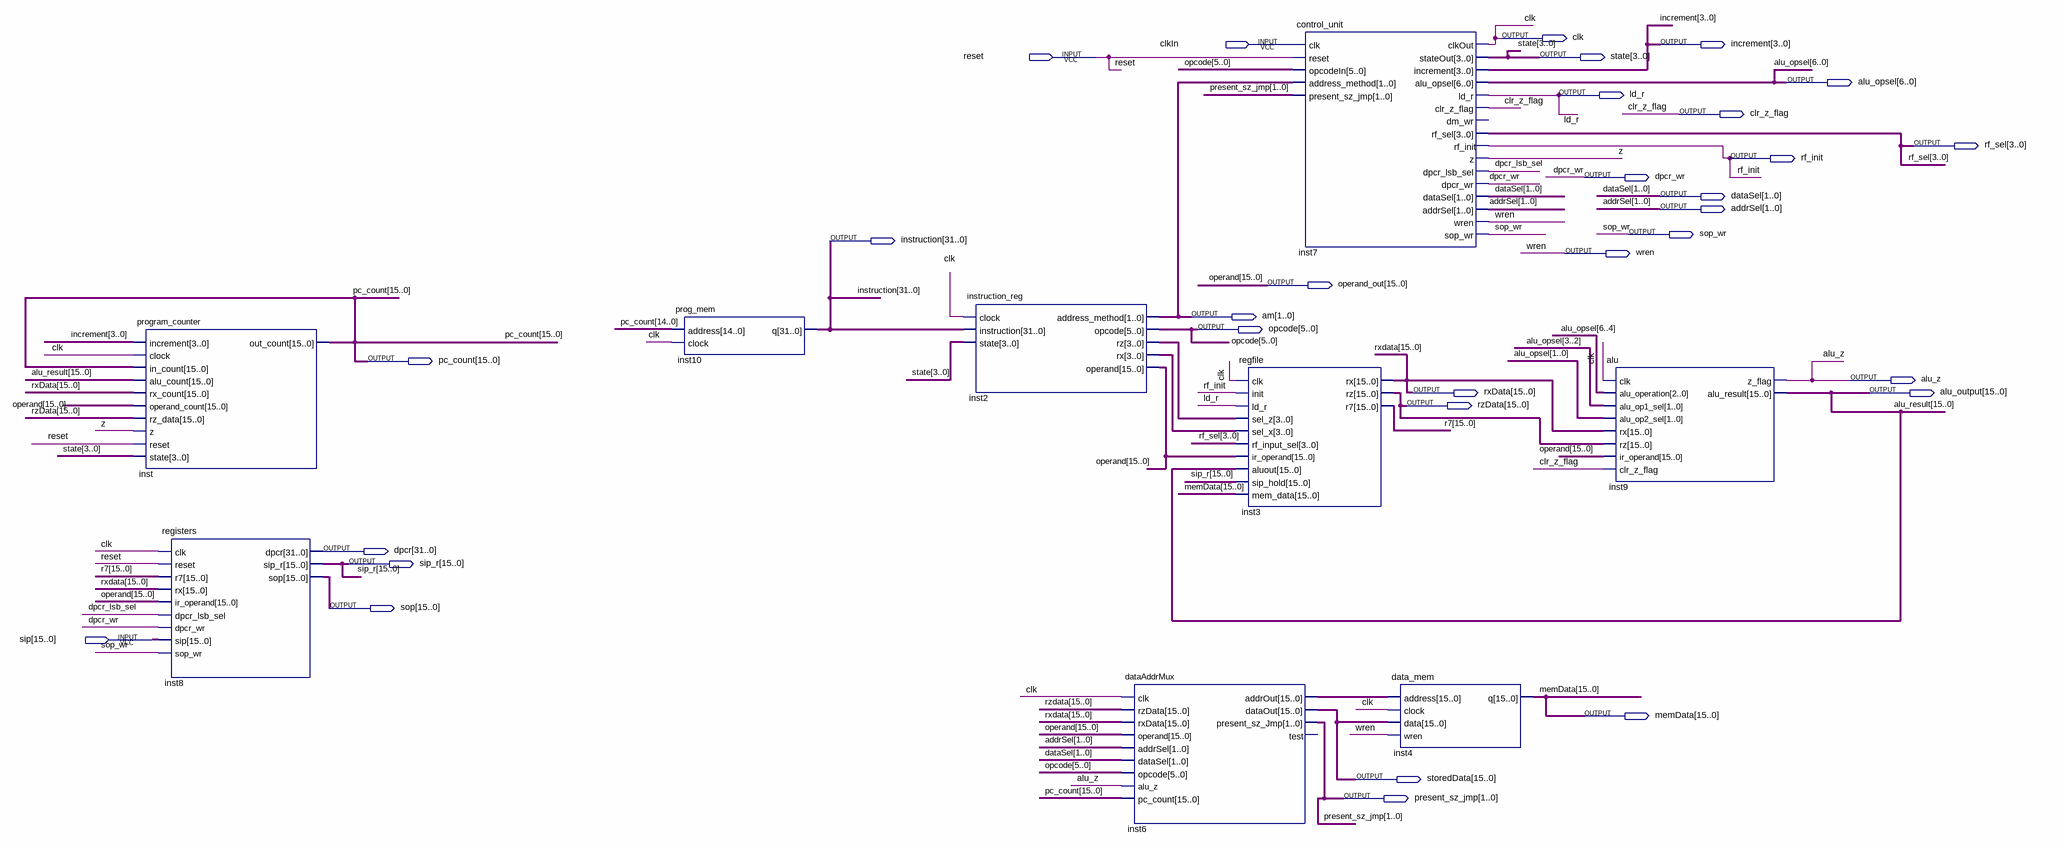
[diagram p0: schematic sheet]
// Quartus schematic progCounterTest.bdf as structural Verilog: 9 symbols, 31 pins
module progCounterTest (
  input  clkIn,
  input  reset,
  input  [15:0] sip,
  output clk,
  output [3:0] increment,
  output [3:0] state,
  output [6:0] alu_opsel,
  output ld_r,
  output clr_z_flag,
  output [3:0] rf_sel,
  output rf_init,
  output dpcr_wr,
  output [1:0] dataSel,
  output [1:0] addrSel,
  output sop_wr,
  output [31:0] instruction,
  output wren,
  output [15:0] operand_out,
  output [1:0] am,
  output [5:0] opcode,
  output [15:0] pc_count,
  output alu_z,
  output [15:0] rxData,
  output [15:0] alu_output,
  output [15:0] rzData,
  output [31:0] dpcr,
  output [15:0] sip_r,
  output [15:0] sop,
  output [15:0] memData,
  output [15:0] storedData,
  output [1:0] present_sz_jmp
);

  wire dpcr_lsb_sel, z;
  wire [3:0] inst2_rx, inst2_rz;
  wire [15:0] inst6_addrout, r7;

  program_counter inst (
    .increment(increment), .clock(clk), .in_count(pc_count), .alu_count(alu_output), .rx_count(rxData),
    .operand_count(operand_out), .rz_data(rzData), .z(z), .reset(reset), .state(state), .out_count(pc_count));
  registers inst8 (
    .clk(clk), .reset(reset), .r7(r7), .rx(rxData), .ir_operand(operand_out), .dpcr_lsb_sel(dpcr_lsb_sel),
    .dpcr_wr(dpcr_wr), .sip(sip), .sop_wr(sop_wr), .dpcr(dpcr), .sip_r(sip_r), .sop(sop));
  prog_mem inst10 (.address(pc_count[14:0]), .clock(clk), .q(instruction));
  instruction_reg inst2 (
    .clock(clk), .instruction(instruction), .state(state), .address_method(am), .opcode(opcode),
    .rz(inst2_rz), .rx(inst2_rx), .operand(operand_out));
  dataAddrMux inst6 (
    .clk(clk), .rzData(rzData), .rxData(rxData), .operand(operand_out), .addrSel(addrSel), .dataSel(dataSel),
    .opcode(opcode), .alu_z(alu_z), .pc_count(pc_count), .addrOut(inst6_addrout), .dataOut(storedData),
    .present_sz_Jmp(present_sz_jmp));  // open: test
  regfile inst3 (
    .clk(clk), .init(rf_init), .ld_r(ld_r), .sel_z(inst2_rz), .sel_x(inst2_rx), .rf_input_sel(rf_sel),
    .ir_operand(operand_out), .aluout(alu_output), .sip_hold(sip_r), .mem_data(memData), .rx(rxData),
    .rz(rzData), .r7(r7));
  control_unit inst7 (
    .clk(clkIn), .reset(reset), .opcodeIn(opcode), .address_method(am), .present_sz_jmp(present_sz_jmp),
    .clkOut(clk), .stateOut(state), .increment(increment), .alu_opsel(alu_opsel), .ld_r(ld_r),
    .clr_z_flag(clr_z_flag), .rf_sel(rf_sel), .rf_init(rf_init), .z(z), .dpcr_lsb_sel(dpcr_lsb_sel),
    .dpcr_wr(dpcr_wr), .dataSel(dataSel), .addrSel(addrSel), .wren(wren), .sop_wr(sop_wr));  // open: dm_wr
  data_mem inst4 (.address(inst6_addrout), .clock(clk), .data(storedData), .wren(wren), .q(memData));
  alu inst9 (
    .clk(clk), .alu_operation(alu_opsel[6:4]), .alu_op1_sel(alu_opsel[3:2]), .alu_op2_sel(alu_opsel[1:0]),
    .rx(rxData), .rz(rzData), .ir_operand(operand_out), .clr_z_flag(clr_z_flag), .z_flag(alu_z),
    .alu_result(alu_output));

  // Other names for the same wires on the sheet: alu_result[15:0] = alu_output; operand[15:0] = operand_out
endmodule
